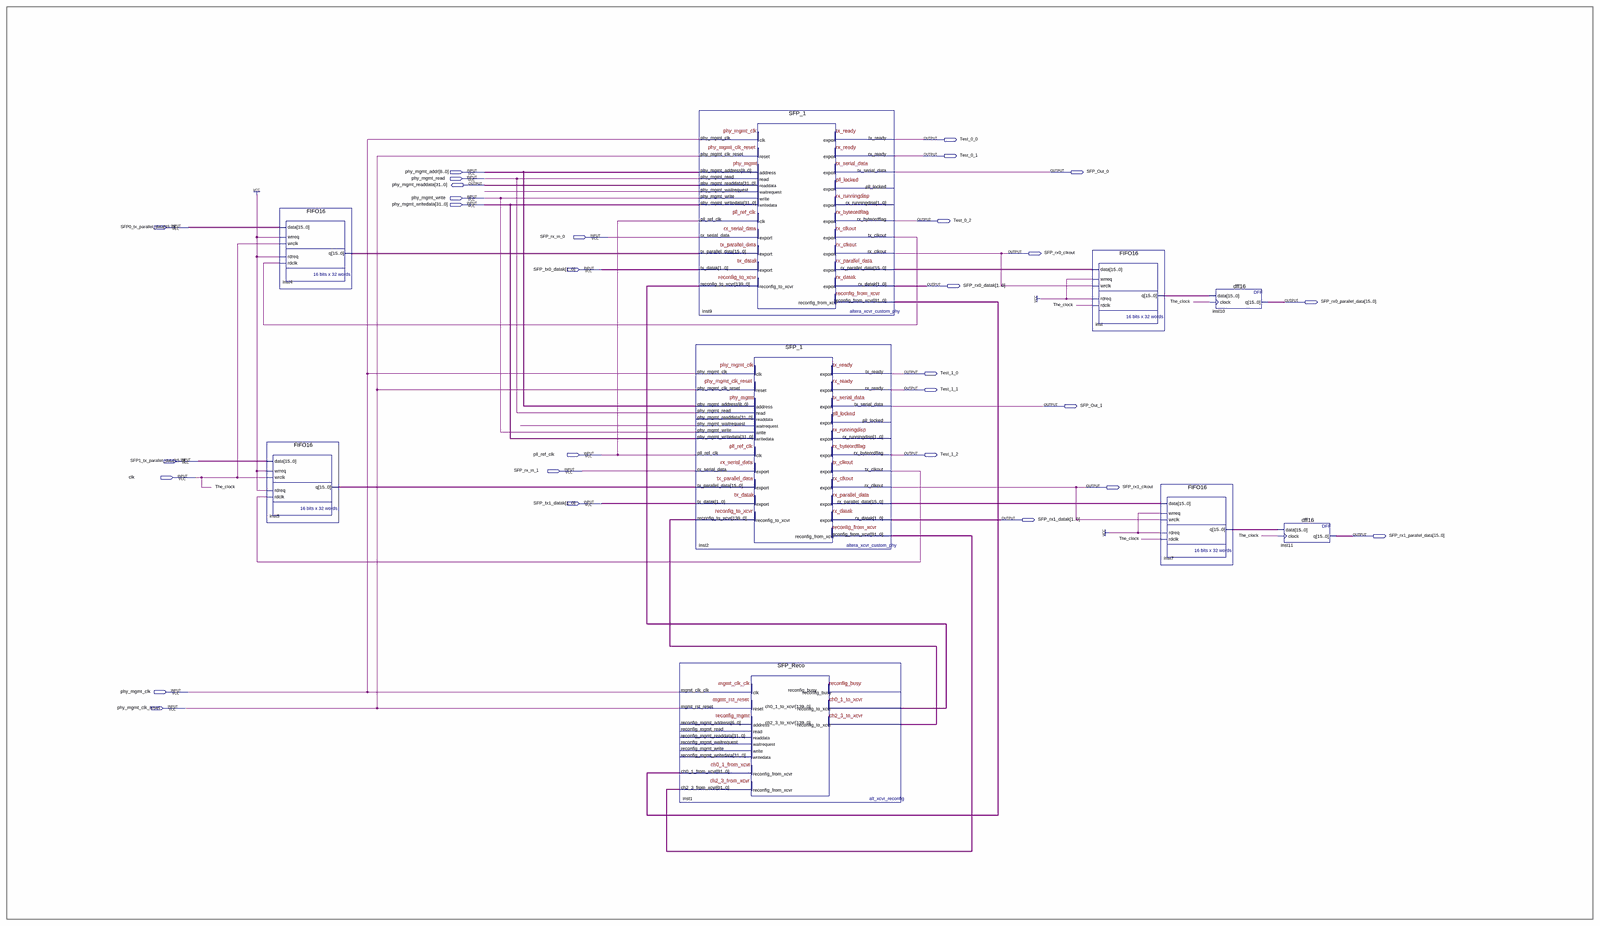
[diagram p0: schematic sheet, whole]
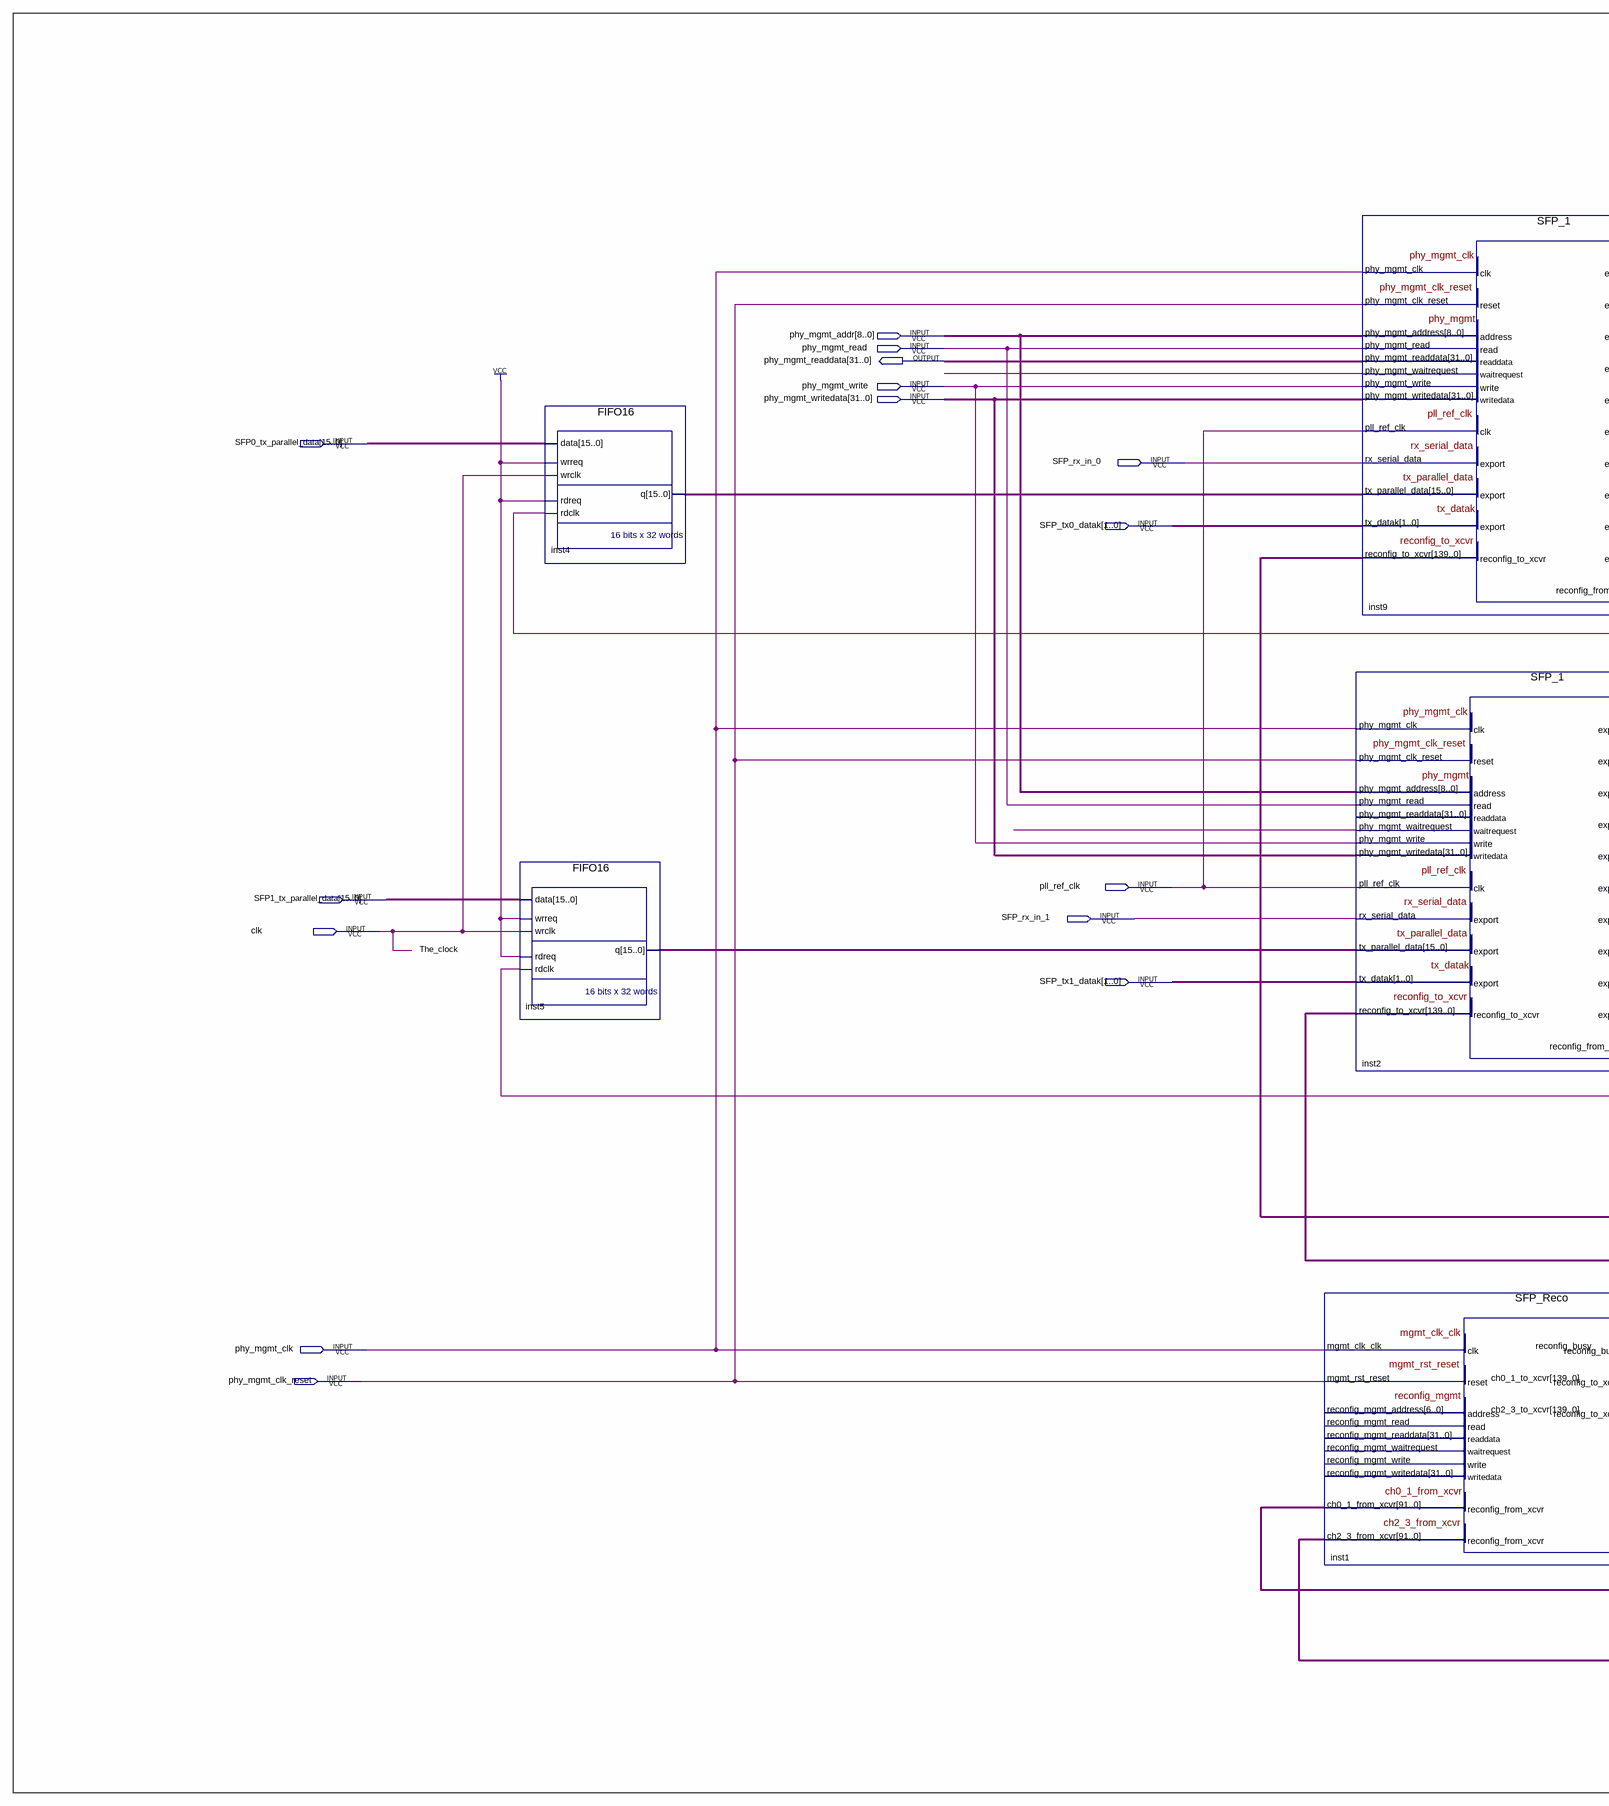
[diagram p1: schematic sheet, left part]
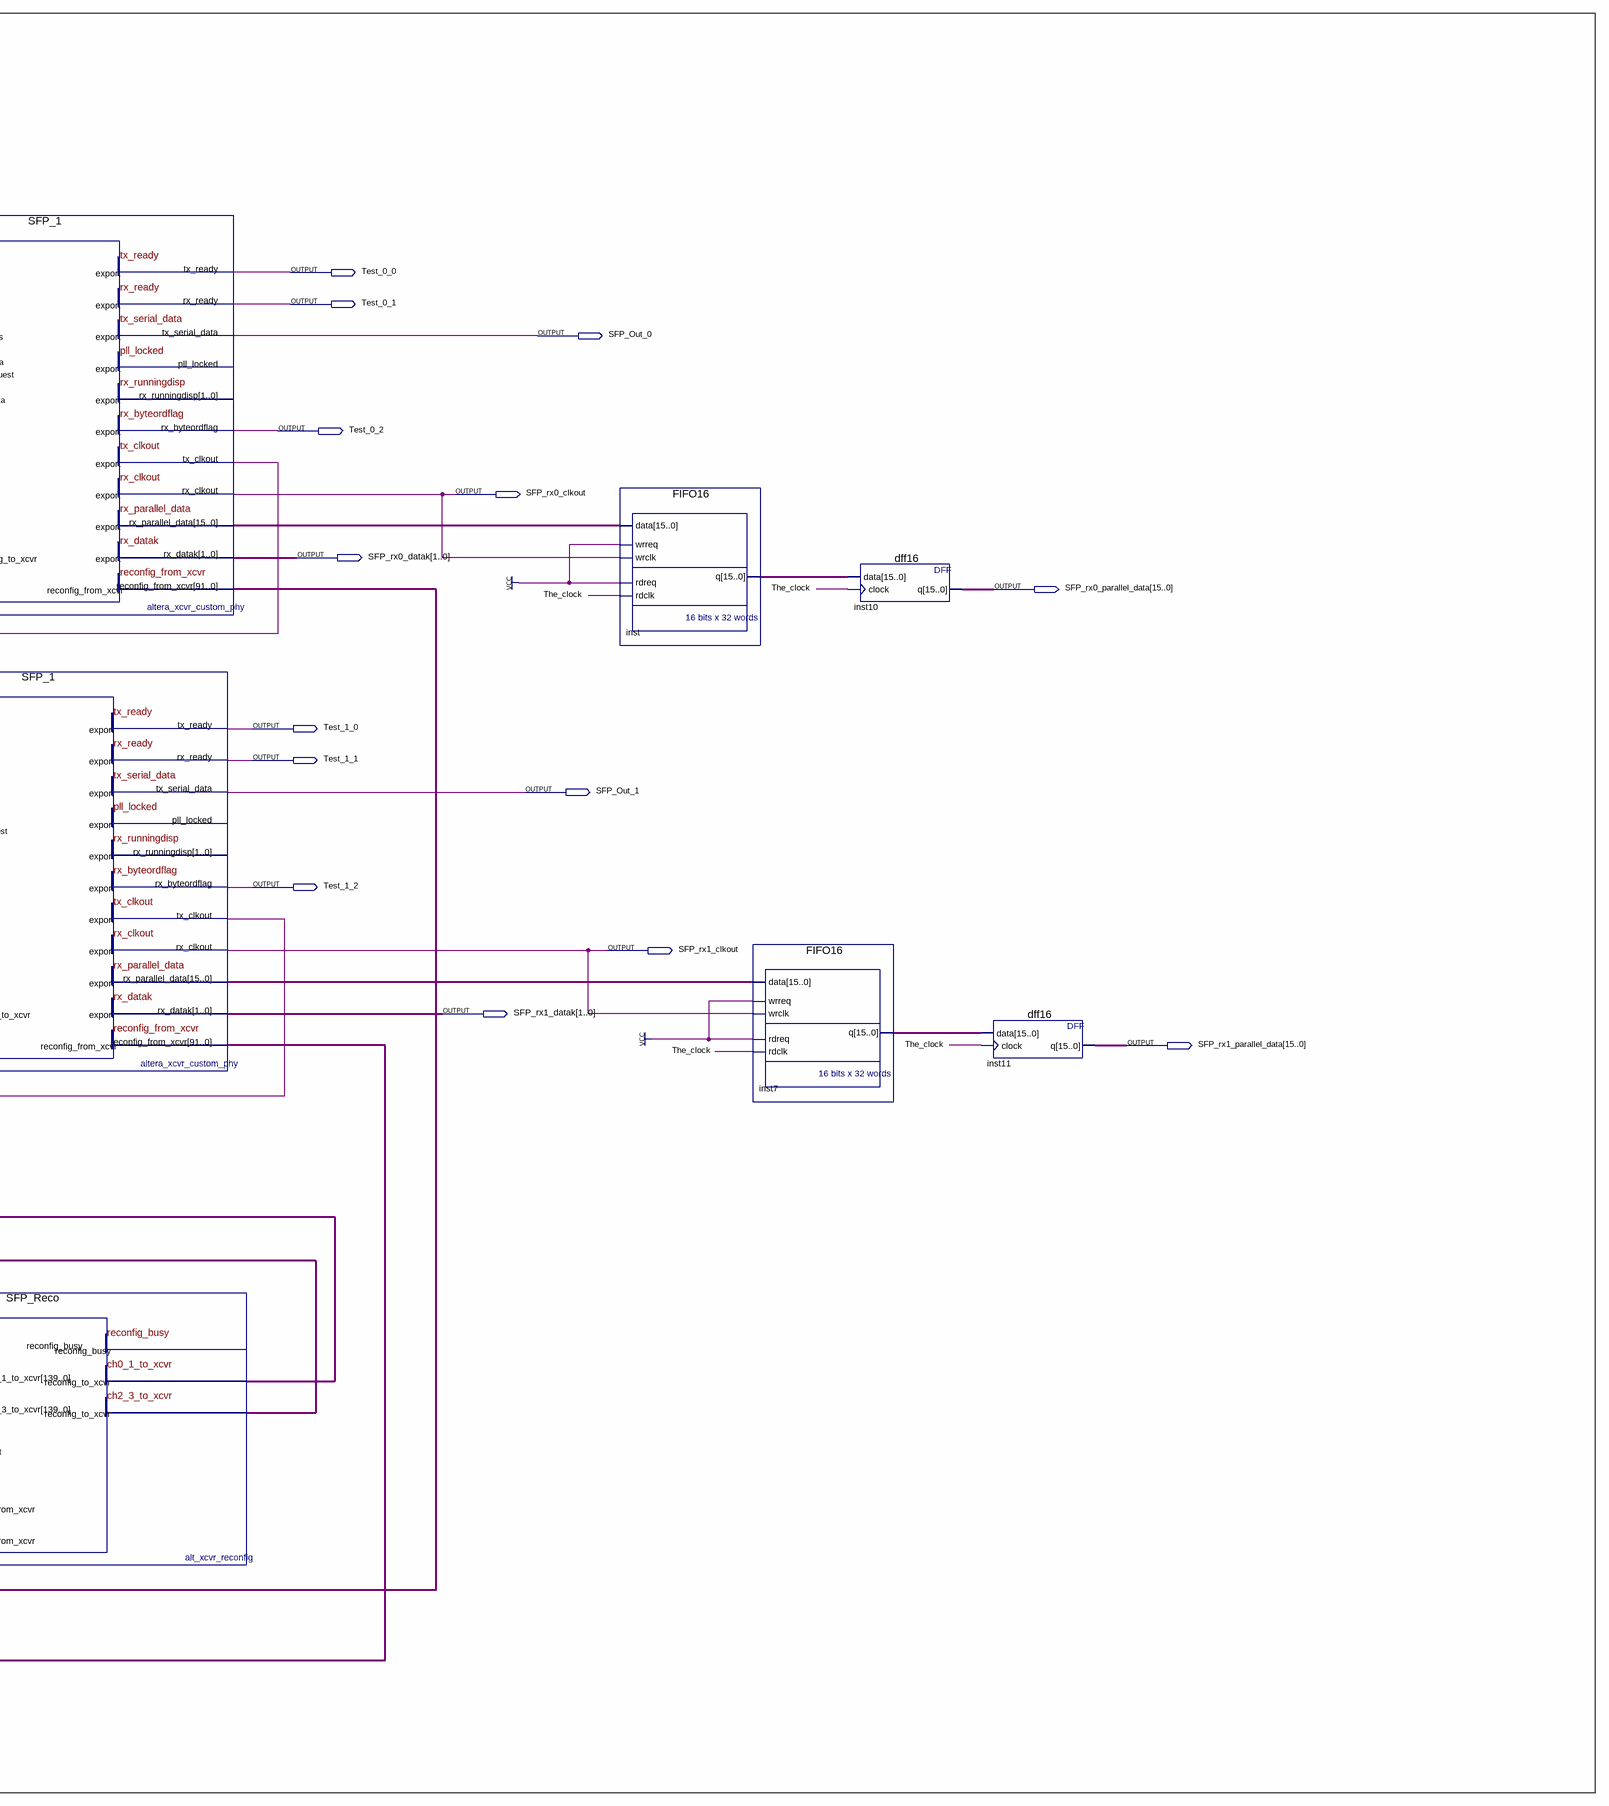
[diagram p2: schematic sheet, right part]
// Quartus schematic SFP_GxBlock.bdf as structural Verilog: 9 symbols, 29 pins
module SFP_GxBlock (
  input  [8:0] phy_mgmt_addr,
  input  phy_mgmt_read,
  input  phy_mgmt_write,
  input  [31:0] phy_mgmt_writedata,
  input  [15:0] SFP0_tx_parallel_data,
  input  SFP_rx_in_0,
  input  [1:0] SFP_tx0_datak,
  input  pll_ref_clk,
  input  [15:0] SFP1_tx_parallel_data,
  input  SFP_rx_in_1,
  input  clk,
  input  [1:0] SFP_tx1_datak,
  input  phy_mgmt_clk,
  input  phy_mgmt_clk_reset,
  output Test_0_0,
  output Test_0_1,
  output SFP_Out_0,
  output [31:0] phy_mgmt_readdata,
  output Test_0_2,
  output SFP_rx0_clkout,
  output [1:0] SFP_rx0_datak,
  output [15:0] SFP_rx0_parallel_data,
  output Test_1_0,
  output Test_1_1,
  output SFP_Out_1,
  output Test_1_2,
  output SFP_rx1_clkout,
  output [1:0] SFP_rx1_datak,
  output [15:0] SFP_rx1_parallel_data
);

  wire inst2_phy_mgmt_waitrequest, inst2_tx_clkout, inst9_phy_mgmt_waitrequest, inst9_tx_clkout;
  wire [15:0] inst2_rx_parallel_data, inst4_q, inst5_q, inst7_q, inst9_rx_parallel_data, inst_q;
  wire [91:0] inst2_reconfig_from_xcvr, inst9_reconfig_from_xcvr;
  wire [139:0] inst1_ch0_1_to_xcvr, inst1_ch2_3_to_xcvr;

  FIFO16 inst4 (
    .data(SFP0_tx_parallel_data), .wrreq(1'b1), .wrclk(clk), .rdreq(1'b1), .rdclk(inst9_tx_clkout),
    .q(inst4_q));
  FIFO16 inst5 (
    .data(SFP1_tx_parallel_data), .wrreq(1'b1), .wrclk(clk), .rdreq(1'b1), .rdclk(inst2_tx_clkout),
    .q(inst5_q));
  SFP_1 inst2 (
    .phy_mgmt_clk(phy_mgmt_clk), .phy_mgmt_clk_reset(phy_mgmt_clk_reset), .phy_mgmt_address(phy_mgmt_addr),
    .phy_mgmt_read(phy_mgmt_read), .phy_mgmt_write(phy_mgmt_write), .phy_mgmt_writedata(phy_mgmt_writedata),
    .pll_ref_clk(pll_ref_clk), .rx_serial_data(SFP_rx_in_1), .tx_parallel_data(inst5_q),
    .tx_datak(SFP_tx1_datak), .reconfig_to_xcvr(inst1_ch2_3_to_xcvr),
    .phy_mgmt_waitrequest(inst2_phy_mgmt_waitrequest), .tx_ready(Test_1_0), .rx_ready(Test_1_1),
    .tx_serial_data(SFP_Out_1), .rx_byteordflag(Test_1_2), .tx_clkout(inst2_tx_clkout),
    .rx_clkout(SFP_rx1_clkout), .rx_parallel_data(inst2_rx_parallel_data), .rx_datak(SFP_rx1_datak),
    .reconfig_from_xcvr(inst2_reconfig_from_xcvr));  // open: phy_mgmt_readdata, pll_locked, rx_runningdisp
  SFP_Reco inst1 (
    .mgmt_clk_clk(phy_mgmt_clk), .mgmt_rst_reset(phy_mgmt_clk_reset),
    .ch0_1_from_xcvr(inst9_reconfig_from_xcvr), .ch2_3_from_xcvr(inst2_reconfig_from_xcvr),
    .ch0_1_to_xcvr(inst1_ch0_1_to_xcvr), .ch2_3_to_xcvr(inst1_ch2_3_to_xcvr));  // open: reconfig_mgmt_address, reconfig_mgmt_read, reconfig_mgmt_write, reconfig_mgmt_writedata, reconfig_busy, reconfig_mgmt_readdata, reconfig_mgmt_waitrequest
  SFP_1 inst9 (
    .phy_mgmt_clk(phy_mgmt_clk), .phy_mgmt_clk_reset(phy_mgmt_clk_reset), .phy_mgmt_address(phy_mgmt_addr),
    .phy_mgmt_read(phy_mgmt_read), .phy_mgmt_write(phy_mgmt_write), .phy_mgmt_writedata(phy_mgmt_writedata),
    .pll_ref_clk(pll_ref_clk), .rx_serial_data(SFP_rx_in_0), .tx_parallel_data(inst4_q),
    .tx_datak(SFP_tx0_datak), .reconfig_to_xcvr(inst1_ch0_1_to_xcvr), .phy_mgmt_readdata(phy_mgmt_readdata),
    .phy_mgmt_waitrequest(inst9_phy_mgmt_waitrequest), .tx_ready(Test_0_0), .rx_ready(Test_0_1),
    .tx_serial_data(SFP_Out_0), .rx_byteordflag(Test_0_2), .tx_clkout(inst9_tx_clkout),
    .rx_clkout(SFP_rx0_clkout), .rx_parallel_data(inst9_rx_parallel_data), .rx_datak(SFP_rx0_datak),
    .reconfig_from_xcvr(inst9_reconfig_from_xcvr));  // open: pll_locked, rx_runningdisp
  FIFO16 inst (
    .data(inst9_rx_parallel_data), .wrreq(1'b1), .wrclk(SFP_rx0_clkout), .rdreq(1'b1), .rdclk(clk), .q(inst_q));
  FIFO16 inst7 (
    .data(inst2_rx_parallel_data), .wrreq(1'b1), .wrclk(SFP_rx1_clkout), .rdreq(1'b1), .rdclk(clk),
    .q(inst7_q));
  dff16 inst10 (.data(inst_q), .clock(clk), .q(SFP_rx0_parallel_data));
  dff16 inst11 (.data(inst7_q), .clock(clk), .q(SFP_rx1_parallel_data));

  // Other names for the same wires on the sheet: The_clock = clk
endmodule
